# EAGLE schematic module (EAGLE 6.1)
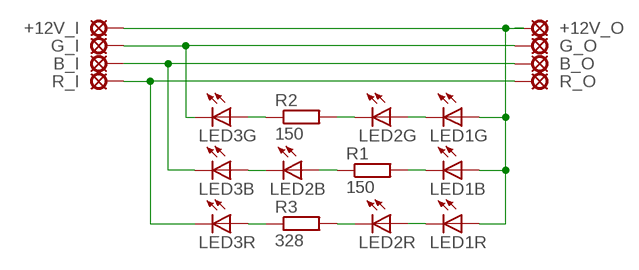
[diagram p0: schematic, sheet 1]

## Parts
+12V_I  LSP10  [LSP10]
+12V_O  LSP10  [LSP10]
B_I  LSP10  [LSP10]
B_O  LSP10  [LSP10]
G_I  LSP10  [LSP10]
G_O  LSP10  [LSP10]
LED1  GM5WA94310A  [GM5WA94310A]
LED2  GM5WA94310A  [GM5WA94310A]
LED3  GM5WA94310A  [GM5WA94310A]
R1  150  R-EU_M1206  [M1206]
R2  150  R-EU_M1206  [M1206]
R3  328  R-EU_M1206  [M1206]
R_I  LSP10  [LSP10]
R_O  LSP10  [LSP10]

## Nets
N$1: +12V_I.MP +12V_O.MP LED1.1(B:A) LED1.2(R:A) LED1.3(G:A)
N$2: LED1.6(B:C) R1.2
N$3: LED2.1(B:A) R1.1
N$4: LED1.4(G:C) LED2.3(G:A)
N$5: B_I.MP B_O.MP LED3.6(B:C)
N$6: LED2.6(B:C) LED3.1(B:A)
N$7: LED1.5(R:C) LED2.2(R:A)
N$8: LED2.5(R:C) R3.2
N$9: LED3.2(R:A) R3.1
N$10: G_I.MP G_O.MP LED3.4(G:C)
N$11: LED2.4(G:C) R2.2
N$12: LED3.5(R:C) R_I.MP R_O.MP
N$13: LED3.3(G:A) R2.1

## Library data of the parts
+12V_I +12V_O B_I B_O G_I G_O R_I R_O = solpad:LSP10: SOLDER PAD drill 1.0 mm, distributor Buerklin, 12H555
LED1-LED3 = led:GM5WA94310A: Chip LED RGB Source: http://document.sharpsma.com/files/GM5WA94310A_SS.pdf
R1-R3 = rcl:R-EU_: RESISTOR, European symbol